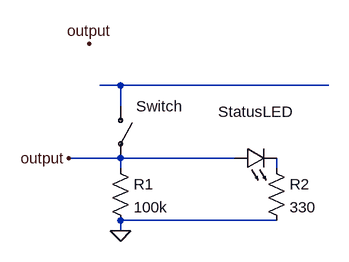
[diagram p0: schematic btn_led_show.asc]
btn_led_show.asc, the LTspice schematic file:
Version 4
SHEET 1 880 680
WIRE 48 64 16 64
WIRE 368 64 48 64
WIRE 48 96 48 64
WIRE 48 176 -32 176
WIRE 224 176 48 176
WIRE 48 192 48 176
WIRE 288 192 288 176
WIRE 288 272 48 272
WIRE 48 288 48 272
FLAG 48 288 0
FLAG -32 176 output
FLAG 0 0 output
SYMBOL csw 48 96 R0
SYMATTR InstName Switch
SYMATTR Value ""
SYMBOL res 32 176 R0
SYMATTR InstName R1
SYMATTR Value 100k
SYMBOL LED 224 192 R270
WINDOW 0 72 32 VTop 2
WINDOW 3 0 32 VBottom 2
SYMATTR InstName StatusLED
SYMATTR Value ""
SYMBOL res 272 176 R0
SYMATTR InstName R2
SYMATTR Value 330

The netlist it stands for:
* btn_led_show.asc
W§Switch N001 output
R1 output 0 100k
D§StatusLED output N002
R2 N002 0 330
.model D D
.lib standard.dio
.backanno
.end